# Altium schematic sheet Sheet1.SchDoc
size A0; SheetNumber: 1; SheetTotal: 1
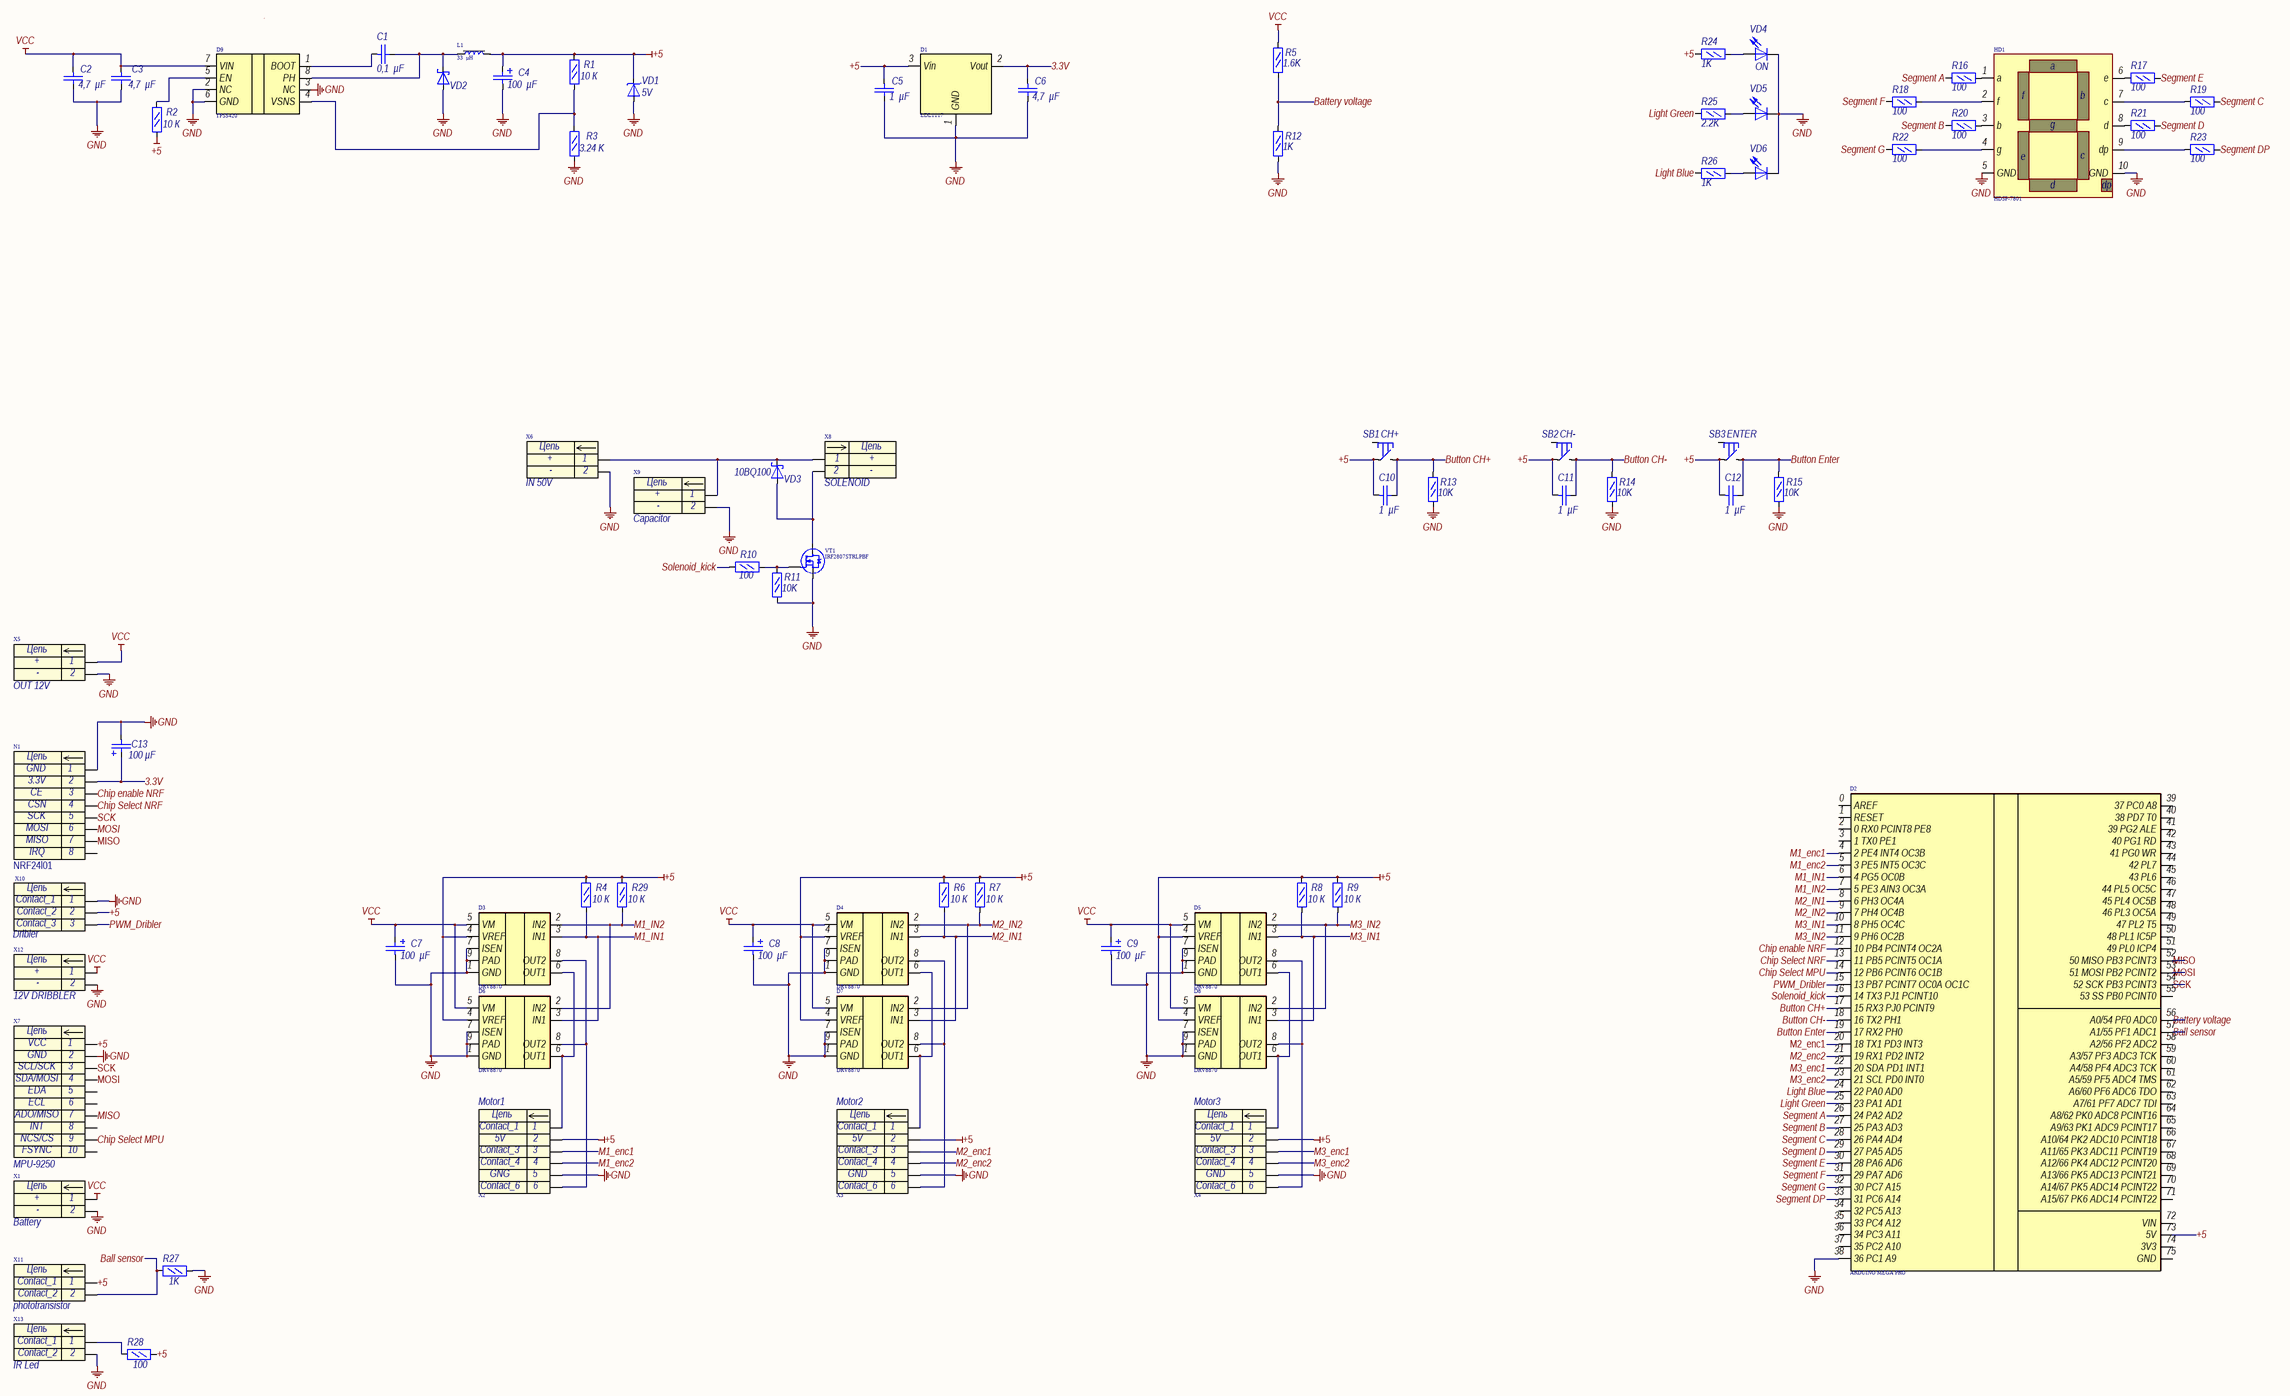
[diagram p0: Sheet1.SchDoc]

## Parts
C1  0,1  µF  [NPC0805]
C2  4,7  µF  [NPC0805]
C3  4,7  µF  [NPC0805]
C4  100  µF  [TANTAL CAPACITOR C]
C5  1  µF  [NPC0805]
C6  4,7  µF  [NPC0805]
C7  100  µF  [TANTAL CAPACITOR C]
C8  100  µF  [TANTAL CAPACITOR C]
C9  100  µF  [TANTAL CAPACITOR C]
C10  1  µF  [NPC0805]
C11  1  µF  [NPC0805]
C12  1  µF  [NPC0805]
C13  100 µF  [TANTAL CAPACITOR D]
D1  LDL1117  [SOT223_M]
D2  ARDUINO MEGA PRO  [Arduino mega pro]
D3  DRV8870  [SOIC8 WITH THERMAL PAD]
D4  DRV8870  [SOIC8 WITH THERMAL PAD]
D5  DRV8870  [SOIC8 WITH THERMAL PAD]
D6  DRV8870  [SOIC8 WITH THERMAL PAD]
D7  DRV8870  [SOIC8 WITH THERMAL PAD]
D8  DRV8870  [SOIC8 WITH THERMAL PAD]
D9  TPS5420  [SO8]
HD1  HDSP-7801  [HDSP-7801]
L1  33  µH  [IND: B82472G]
N1  NRF24l01  [NRF24l01]
R1  10 К  [R0805]
R2  10 К  [R0805]
R3  3.24 K  [R0805]
R4  10 К  [R0805]
R5  1.6K  [R0805]
R6  10 К  [R0805]
R7  10 К  [R0805]
R8  10 К  [R0805]
R9  10 К  [R0805]
R10  100  [R0805]
R11  10K  [R0805]
R12  1K  [R0805]
R13  10K  [R0805]
R14  10K  [R0805]
R15  10K  [R0805]
R16  100  [R0805]
R17  100  [R0805]
R18  100  [R0805]
R19  100  [R0805]
R20  100  [R0805]
R21  100  [R0805]
R22  100  [R0805]
R23  100  [R0805]
R24  1K  [R0805]
R25  2.2K  [R0805]
R26  1K  [R0805]
R27  1K  [R0805]
R28  100  [R0805]
R29  10 К  [R0805]
SB1  Function: CH+  [1-1437565-6 WITH LABEL]
SB2  Function: CH-  [1-1437565-6 WITH LABEL]
SB3  Function: ENTER  [1-1437565-6 WITH LABEL]
VD1  5V  [DO-214AC]
VD2  (no value)  [SOD123]
VD3  10BQ100  [DO-214AA]
VD4  ON  [0805_LED _RED]
VD5  (no value)  [0805_LED _GREEN]
VD6  (no value)  [0805_LED _BLUE]
VT1  IRF2807STRLPBF  [D2PAK]
X1  Battery  [KLS2-301-5.00 WITH LABEL]
X2  Motor1  [PLS-6]
X3  Motor2  [PLS-6]
X4  Motor3  [PLS-6]
X5  OUT 12V  [KLS2-301-5.00 WITH LABEL]
X6  IN 50V  [KLS2-301-5.00 WITH LABEL]
X7  MPU-9250  [MPU-9250]
X8  SOLENOID  [KLS2-301-5.00 WITH LABEL]
X9  Capacitor  [KLS2-301-5.00 WITH LABEL]
X10  Dribler  [PLS-3]
X11  phototransistor  [JST B2B-XH-A]
X12  12V DRIBBLER  [KLS2-301-5.00 WITH LABEL]
X13  IR Led  [JST B2B-XH-A]

## Nets
+5: C4.1 C5.2 C10.2 C11.2 C12.2 D1.3(Vin) D2.73(5V) D3.4(VREF) D4.4(VREF) D5.4(VREF) D6.4(VREF) D7.4(VREF) D8.4(VREF) L1.1 R1.2 R2.1 R4.2 R6.2 R7.2 R8.2 R9.2 R24.2 R28.1 R29.2 SB1.1 SB2.1 SB3.1 VD1.1(K) X2.2 X3.2 X4.2 X7.1(VCC) X10.2 X11.1
GND: C2.1 C3.1 C4.2 C5.1 C6.1 C7.2 C8.2 C9.2 C13.2 D1.1(GND) D2.38(36_PC1_A9) D3.1(GND) D3.7(ISEN) D3.9(PAD) D4.1(GND) D4.7(ISEN) D4.9(PAD) D5.1(GND) D5.7(ISEN) D5.9(PAD) D6.1(GND) D6.7(ISEN) D6.9(PAD) D7.1(GND) D7.7(ISEN) D7.9(PAD) D8.1(GND) D8.7(ISEN) D8.9(PAD) D9.2(NC) D9.3(NC) D9.6(GND) HD1.5(GND) HD1.10(GND) N1.1 R3.1 R11.1 R12.1 R13.1 R14.1 R15.1 R27.1 VD1.2(A) VD2.2(A) VD4.1(K) VD5.1(K) VD6.1(K) VT1.3(S) X1.2 X2.5 X3.5 X4.5 X5.2 X6.2 X7.2 X9.2 X10.1 X12.2 X13.2
VCC: C2.2 C3.2 C7.1 C8.1 C9.1 D3.5(VM) D4.5(VM) D5.5(VM) D6.5(VM) D7.5(VM) D8.5(VM) D9.7(VIN) R5.2 X1.1 X5.1 X12.1
3.3V: C6.2 C13.1 D1.2(Vout) N1.2
Ball sensor: D2.57(A1/55_PF1_ADC1) R27.2 X11.2
Battery voltage: D2.56(A0/54_PF0_ADC0) R5.1 R12.2
Button CH+: C10.1 D2.17(15_RX3_PJ0_PCINT9) R13.2 SB1.2
Button CH-: C11.1 D2.18(16_TX2_PH1) R14.2 SB2.2
Button Enter: C12.1 D2.19(17_RX2_PH0) R15.2 SB3.2
Chip enable NRF: D2.12(10_PB4_PCINT4_OC2A) N1.3
Chip Select MPU: D2.14(12_PB6_PCINT6_OC1B) X7.9
Chip Select NRF: D2.13(11_PB5_PCINT5_OC1A) N1.4
Light Blue: D2.24(22_PA0_AD0) R26.2
Light Green: D2.25(23_PA1_AD1) R25.2
M1_enc1: D2.4(2_PE4_INT4_OC3B) X2.3
M1_enc2: D2.5(3_PE5_INT5_OC3C) X2.4
M1_IN1: D2.6(4_PG5_OC0B) D3.3(IN1) D6.3(IN1) R4.1
M1_IN2: D2.7(5_PE3_AIN3_OC3A) D3.2(IN2) D6.2(IN2) R29.1
M2_enc1: D2.20(18_TX1_PD3_INT3) X3.3
M2_enc2: D2.21(19_RX1_PD2_INT2) X3.4
M2_IN1: D2.8(6_PH3_OC4A) D4.3(IN1) D7.3(IN1) R6.1
M2_IN2: D2.9(7_PH4_OC4B) D4.2(IN2) D7.2(IN2) R7.1
M3_enc1: D2.22(20_SDA_PD1_INT1) X4.3
M3_enc2: D2.23(21_SCL_PD0_INT0) X4.4
M3_IN1: D2.10(8_PH5_OC4C) D5.3(IN1) D8.3(IN1) R8.1
M3_IN2: D2.11(9_PH6_OC2B) D5.2(IN2) D8.2(IN2) R9.1
MISO: D2.52(50_MISO_PB3_PCINT3) N1.7 X7.7
MOSI: D2.53(51_MOSI_PB2_PCINT2) N1.6 X7.4
PWM_Dribler: D2.15(13_PB7_PCINT7_OC0A_OC1C) X10.3
SCK: D2.54(52_SCK_PB3_PCINT3) N1.5 X7.3
Segment A: D2.26(24_PA2_AD2) R16.2
Segment B: D2.27(25_PA3_AD3) R20.2
Segment C: D2.28(26_PA4_AD4) R19.1
Segment D: D2.29(27_PA5_AD5) R21.1
Segment DP: D2.33(31_PC6_A14) R23.1
Segment E: D2.30(28_PA6_AD6) R17.1
Segment F: D2.31(29_PA7_AD6) R18.2
Segment G: D2.32(30_PC7_A15) R22.2
Solenoid_kick: D2.16(14_TX3_PJ1_PCINT10) R10.1
NetC1_1: C1.1 D9.8(PH) L1.2 VD2.1(K)
NetC1_2: C1.2 D9.1(BOOT)
NetD3_6: D3.6(OUT1) D6.6(OUT1) X2.1
NetD3_8: D3.8(OUT2) D6.8(OUT2) X2.6
NetD4_6: D4.6(OUT1) D7.6(OUT1) X3.1
NetD4_8: D4.8(OUT2) D7.8(OUT2) X3.6
NetD5_6: D5.6(OUT1) D8.6(OUT1) X4.1
NetD5_8: D5.8(OUT2) D8.8(OUT2) X4.6
NetD9_4: D9.4(VSNS) R1.1 R3.2
NetD9_5: D9.5(EN) R2.2
NetHD1_1: HD1.1(a) R16.1
NetHD1_2: HD1.2(f) R18.1
NetHD1_3: HD1.3(b) R20.1
NetHD1_4: HD1.4(g) R22.1
NetHD1_6: HD1.6(e) R17.2
NetHD1_7: HD1.7(c) R19.2
NetHD1_8: HD1.8(d) R21.2
NetHD1_9: HD1.9(dp) R23.2
NetR10_2: R10.2 R11.2 VT1.1(G)
NetR24_1: R24.1 VD4.2(A)
NetR25_1: R25.1 VD5.2(A)
NetR26_1: R26.1 VD6.2(A)
NetR28_2: R28.2 X13.1
NetVD3_1: VD3.1(K) X6.1 X8.1 X9.1
NetVD3_2: VD3.2(A) VT1.2(D) X8.2

Not connected (* = marked no-connect by the designer): D2 0(AREF) 1(RESET) 2(0_RX0_PCINT8_PE8) 3(1_TX0_PE1) 34(32_PC5_A13) 35(33_PC4_A12) 36(34_PC3_A11) 37(35_PC2_A10) 39(37_PC0_A8) 40(38_PD7_T0) 41(39_PG2_ALE) 42(40_PG1_RD) 43(41_PG0_WR) 44(42_PL7) 45(43_PL6) 46(44_PL5_OC5C) 47(45_PL4_OC5B) 48(46_PL3_OC5A) 49(47_PL2_T5) 50(48_PL1_IC5P) 51(49_PL0_ICP4) 55(53_SS_PB0_PCINT0) 58(A2/56_PF2_ADC2) 59(A3/57_PF3_ADC3_TCK) 60(A4/58_PF4_ADC3_TCK) 61(A5/59_PF5_ADC4_TMS) 62(A6/60_PF6_ADC6_TDO) 63(A7/61_PF7_ADC7_TDI) 64(A8/62_PK0_ADC8_PCINT16) 65(A9/63_PK1_ADC9_PCINT17) 66(A10/64_PK2_ADC10_PCINT18) 67(A11/65_PK3_ADC11_PCINT19) 68(A12/66_PK4_ADC12_PCINT20) 69(A13/66_PK5_ADC13_PCINT21) 70(A14/67_PK5_ADC14_PCINT22) 71(A15/67_PK6_ADC14_PCINT22) 72(VIN) 74(3V3) 75(GND); N1 8; SB1 3(GND); SB2 3(GND); SB3 3(GND); X7 5 6 8 10

## Notes on the sheet
- (in symbol Header_2_plg) Цепь
- (in symbol Header_3_plg) Цепь
- (in symbol Header_6_plg) Цепь
- (in symbol MPU-9250) Цепь; GND; SCL/SCK; SDA/MOSI; EDA; ECL; ADO/MISO; INT; NCS/CS; FSYNC
- (in symbol NRF24l01) Цепь; GND; 3.3V; CE; CSN; SCK; MOSI; MISO; IRQ

## Library data of the parts
C1-C3 C5 C6 C10-C12 = Capacitor ceramic: Конденсатор кер.
  C1: Value: 0,1  µF
  C2 C3 C6: Value: 4,7  µF
  C5 C10-C12: Value: 1  µF
C4 C7-C9 C13 = Capacitor tantal: Конденсатор пол.
  C4 C7-C9: Value: 100  µF
  C13: Value: 100 µF
D1 = LDL1117: DC-DC преобразователь
D2 = ARDUINO MEGA PRO: Микроконтроллер
D3-D8 = DRV8870: Драйвер моторов
L1 = Throttle B82472G: Value: 33  µH
R1-R29 = Резистор  0,125Вт: Power rating: 0,125Вт
  R1 R2 R4 R6-R9 R29: Value: 10 К
  R3: Value: 3.24 K
  R5: Value: 1.6K
  R10 R16-R23 R28: Value: 100
  R11 R13-R15: Value: 10K
  R12 R24 R26 R27: Value: 1K
  R25: Value: 2.2K
SB1-SB3 = Button_SMD: Кнопка без фиксации
VD1 = Diode TVS: Защитный диод (Супрессор); Name: SMAJ 5.0; Value: 5V
VD2 = DiodeSchottky: Диод Шоттки
VD3 = DiodeSchottky: Диод Шоттки; Vr: 100V; Imax: 1A; Name: 10BQ100
VD4-VD6 = LED: Светодиод SMD; Manufacturer: KGB; Forward voltage; 25мА: 2,15В; Max. forward current (continuous): 25мА; Package: 0603
VT1 = N_MOSFET: N-канальный транзистор; Max. drain current (continuous); 25C: 82; Max. voltage drain-to-source: 75; Name: IRF2807STRLPBF
X1 X5 X6 X8 X9 X12 = Header_2_plg: Разъем - 2 конт. вилка; Contact_1: +; Contact_2: -
  X1: Name: Battery
  X5: Name: OUT 12V
  X6: Name: IN 50V
  X8: Name: SOLENOID
  X9: Name: Capacitor
  X12: Name: 12V DRIBBLER
X2 = Header_6_plg: Разъем - 6 конт. вилка; Contact_2: 5V; Contact_5: GNG; Contact_1: Contact_1; Contact_3: Contact_3; Contact_4: Contact_4; Contact_6: Contact_6
X3 X4 = Header_6_plg: Разъем - 6 конт. вилка; Contact_2: 5V; Contact_5: GND; Contact_1: Contact_1; Contact_3: Contact_3; Contact_4: Contact_4; Contact_6: Contact_6
X10 = Header_3_plg: Разъем - 3 конт. вилка; Contact_1: Contact_1; Contact_2: Contact_2; Contact_3: Contact_3
X11 X13 = Header_2_plg: Разъем - 2 конт. вилка; Contact_1: Contact_1; Contact_2: Contact_2
  X11: Name: phototransistor
  X13: Name: IR Led